# Altium schematic sheet 04pwr_pmic.SchDoc
size B
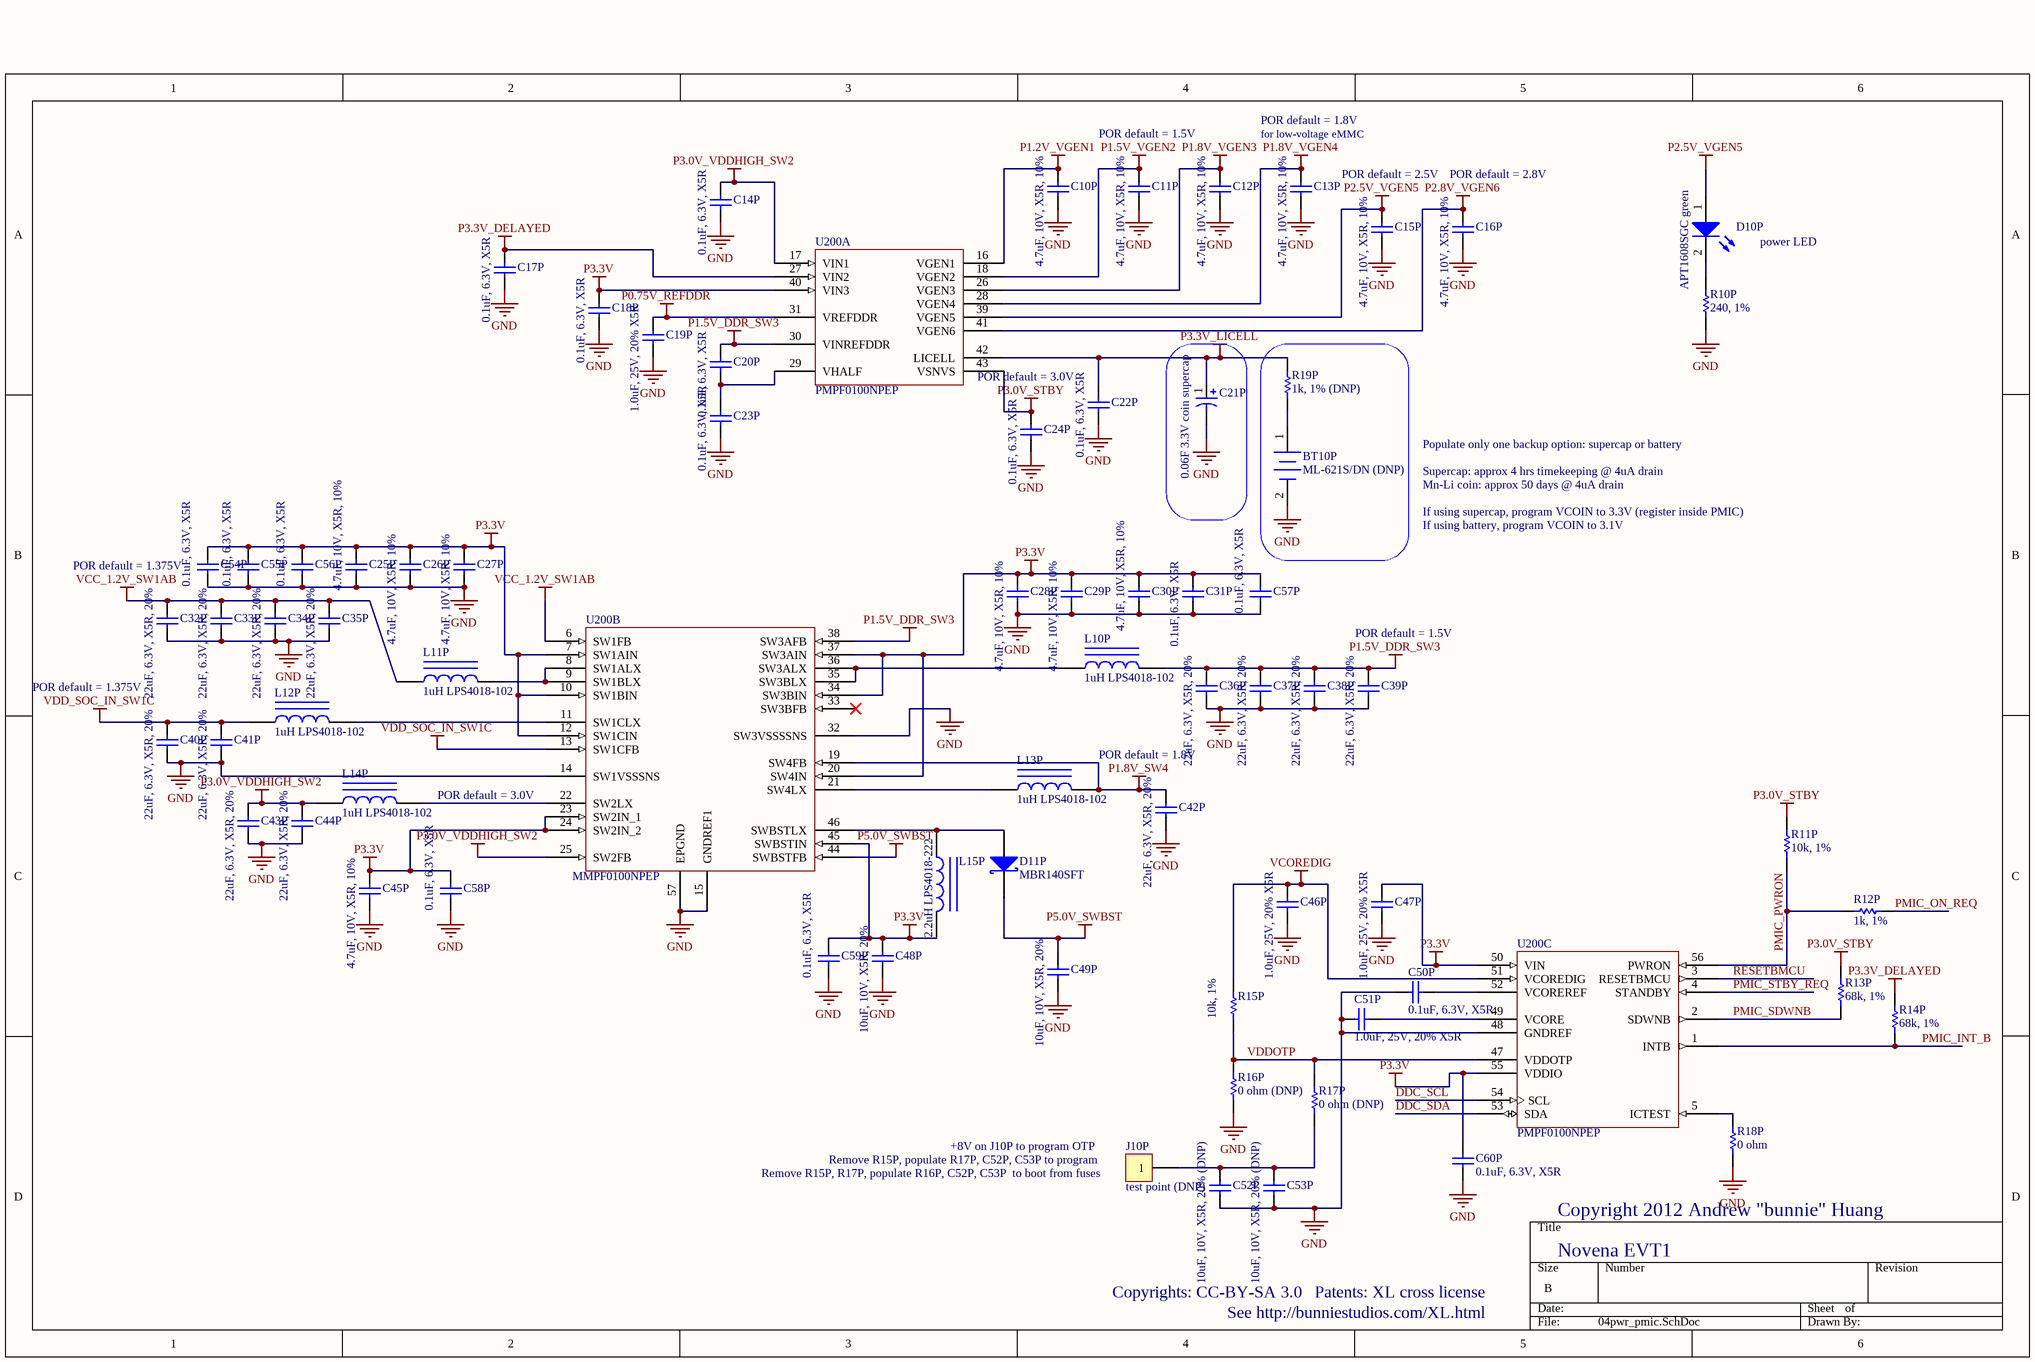
[diagram p0: 04pwr_pmic.SchDoc]

## Parts
BT10P  ML-621S/DN (DNP)  [PAN_ML-621S-DN]
C10P  4.7uF, 10V, X5R, 10%  [CAPC1608N_HD]
C11P  4.7uF, 10V, X5R, 10%  [CAPC1608N_HD]
C12P  4.7uF, 10V, X5R, 10%  [CAPC1608N_HD]
C13P  4.7uF, 10V, X5R, 10%  [CAPC1608N_HD]
C14P  0.1uF, 6.3V, X5R  [CAPC0603N_B]
C15P  4.7uF, 10V, X5R, 10%  [CAPC1608N_HD]
C16P  4.7uF, 10V, X5R, 10%  [CAPC1608N_HD]
C17P  0.1uF, 6.3V, X5R  [CAPC0603N_B]
C18P  0.1uF, 6.3V, X5R  [CAPC0603N_B]
C19P  1.0uF, 25V, 20% X5R  [CAPC1608N_HD]
C20P  0.1uF, 6.3V, X5R  [CAPC0603N_B]
C21P  0.06F 3.3V coin supercap  [TAIYO_YUDEN_PAS414HR-VA5R]
C22P  0.1uF, 6.3V, X5R  [CAPC0603N_B]
C23P  0.1uF, 6.3V, X5R  [CAPC0603N_B]
C24P  0.1uF, 6.3V, X5R  [CAPC0603N_B]
C25P  4.7uF, 10V, X5R, 10%  [CAPC1608N_HD]
C26P  4.7uF, 10V, X5R, 10%  [CAPC1608N_HD]
C27P  4.7uF, 10V, X5R, 10%  [CAPC1608N_HD]
C28P  4.7uF, 10V, X5R, 10%  [CAPC1608N_HD]
C29P  4.7uF, 10V, X5R, 10%  [CAPC1608N_HD]
C30P  4.7uF, 10V, X5R, 10%  [CAPC1608N_HD]
C31P  0.1uF, 6.3V, X5R  [CAPC0603N_B]
C32P  22uF, 6.3V, X5R, 20%  [CAPC1608N_HD]
C33P  22uF, 6.3V, X5R, 20%  [CAPC1608N_HD]
C34P  22uF, 6.3V, X5R, 20%  [CAPC1608N_HD]
C35P  22uF, 6.3V, X5R, 20%  [CAPC1608N_HD]
C36P  22uF, 6.3V, X5R, 20%  [CAPC1608N_HD]
C37P  22uF, 6.3V, X5R, 20%  [CAPC1608N_HD]
C38P  22uF, 6.3V, X5R, 20%  [CAPC1608N_HD]
C39P  22uF, 6.3V, X5R, 20%  [CAPC1608N_HD]
C40P  22uF, 6.3V, X5R, 20%  [CAPC1608N_HD]
C41P  22uF, 6.3V, X5R, 20%  [CAPC1608N_HD]
C42P  22uF, 6.3V, X5R, 20%  [CAPC1608N_HD]
C43P  22uF, 6.3V, X5R, 20%  [CAPC1608N_HD]
C44P  22uF, 6.3V, X5R, 20%  [CAPC1608N_HD]
C45P  4.7uF, 10V, X5R, 10%  [CAPC1608N_HD]
C46P  1.0uF, 25V, 20% X5R  [CAPC1608N_HD]
C47P  1.0uF, 25V, 20% X5R  [CAPC1608N_HD]
C48P  10uF, 10V, X5R, 20%  [CAPC1608N]
C49P  10uF, 10V, X5R, 20%  [CAPC1608N]
C50P  0.1uF, 6.3V, X5R  [CAPC0603N_B]
C51P  1.0uF, 25V, 20% X5R  [CAPC1608N_HD]
C52P  10uF, 10V, X5R, 20% (DNP)  [CAPC1608N]
C53P  10uF, 10V, X5R, 20% (DNP)  [CAPC1608N]
C54P  0.1uF, 6.3V, X5R  [CAPC0603N_B]
C55P  0.1uF, 6.3V, X5R  [CAPC0603N_B]
C56P  0.1uF, 6.3V, X5R  [CAPC0603N_B]
C57P  0.1uF, 6.3V, X5R  [CAPC0603N_B]
C58P  0.1uF, 6.3V, X5R  [CAPC0603N_B]
C59P  0.1uF, 6.3V, X5R  [CAPC0603N_B]
C60P  0.1uF, 6.3V, X5R  [CAPC0603N_B]
D10P  APT1608SGC green  [CD1608-0603]
D11P  MBR140SFT  [SOD123]
J10P  test point (DNP)  [TP_SMT_38mil]
L10P  1uH LPS4018-102  [COILCRAFT_LPS4018]
L11P  1uH LPS4018-102  [COILCRAFT_LPS4018]
L12P  1uH LPS4018-102  [COILCRAFT_LPS4018]
L13P  1uH LPS4018-102  [COILCRAFT_LPS4018]
L14P  1uH LPS4018-102  [COILCRAFT_LPS4018]
L15P  2.2uH LPS4018-222  [COILCRAFT_LPS4018]
R10P  240, 1%  [RESC1005N]
R11P  10k, 1%  [RESC1005N]
R12P  1k, 1%  [RESC1005N]
R13P  68k, 1%  [RESC1005N]
R14P  68k, 1%  [RESC1005N]
R15P  10k, 1%  [RESC1005N]
R16P  0 ohm (DNP)  [RESC1005N]
R17P  0 ohm (DNP)  [RESC1005N]
R18P  0 ohm  [RESC1005N]
R19P  1k, 1% (DNP)  [RESC1005N]
U200  PMPF0100NPEP  [FREESCALE_QFN50P800X800X90-56N]  (parts A,B,C of 3)

## Nets
GND: BT10P.2(-) C10P.2 C11P.2 C12P.2 C13P.2 C14P.2 C15P.2 C16P.2 C17P.2 C18P.2 C19P.2 C21P.2 C22P.2 C23P.2 C24P.2 C25P.2 C26P.2 C27P.2 C28P.2 C29P.2 C30P.2 C31P.2 C32P.2 C33P.2 C34P.2 C35P.2 C36P.2 C37P.2 C38P.2 C39P.2 C40P.2 C41P.2 C42P.2 C43P.2 C44P.2 C45P.2 C46P.2 C47P.2 C48P.2 C49P.2 C50P.2 C51P.2 C52P.2 C53P.2 C54P.2 C55P.2 C56P.2 C57P.2 C58P.2 C59P.2 C60P.1 R10P.1 R16P.1 R18P.1 U200.14(SW1VSSSNS) U200.15(GNDREF1) U200.32(SW3VSSSSNS) U200.48(GNDREF) U200.57(EPGND)
P0.75V_REFDDR: C19P.1 U200.31(VREFDDR)
P1.2V_VGEN1: C10P.1 U200.16(VGEN1)
P1.5V_DDR_SW3: C20P.1 C36P.1 C37P.1 C38P.1 C39P.1 L10P.2 U200.30(VINREFDDR) U200.38(SW3AFB)
P1.5V_VGEN2: C11P.1 U200.18(VGEN2)
P1.8V_SW4: C42P.1 L13P.2 U200.19(SW4FB)
P1.8V_VGEN3: C12P.1 U200.26(VGEN3)
P1.8V_VGEN4: C13P.1 U200.28(VGEN4)
P2.5V_VGEN5: C15P.1 D10P.1(A) U200.39(VGEN5)
P2.8V_VGEN6: C16P.1 U200.41(VGEN6)
P3.0V_STBY: C24P.1 R11P.2 R13P.2 U200.43(VSNVS)
P3.0V_VDDHIGH_SW2: C14P.1 C43P.1 C44P.1 L14P.1 U200.17(VIN1) U200.25(SW2FB)
P3.3V: C18P.1 C25P.1 C26P.1 C27P.1 C28P.1 C29P.1 C30P.1 C31P.1 C45P.1 C47P.1 C48P.1 C54P.1 C55P.1 C56P.1 C57P.1 C58P.1 C59P.1 C60P.2 L15P.2 U200.7(SW1AIN) U200.10(SW1BIN) U200.12(SW1CIN) U200.20(SW4IN) U200.23(SW2IN_1) U200.24(SW2IN_2) U200.34(SW3BIN) U200.37(SW3AIN) U200.40(VIN3) U200.45(SWBSTIN) U200.50(VIN) U200.55(VDDIO)
P3.3V_DELAYED: C17P.1 R14P.2 U200.27(VIN2)
P3.3V_LICELL: C21P.1 C22P.1 R19P.2 U200.42(LICELL)
P5.0V_SWBST: C49P.1 D11P.2(K) U200.44(SWBSTFB)
VCC_1.2V_SW1AB: C32P.1 C33P.1 C34P.1 C35P.1 L11P.1 U200.6(SW1FB)
VCOREDIG: C46P.1 R15P.2 U200.51(VCOREDIG)
VDD_SOC_IN_SW1C: C40P.1 C41P.1 L12P.1 U200.13(SW1CFB)
DDC_SCL: U200.54(SCL)
DDC_SDA: U200.53(SDA)
PMIC_INT_B: R14P.1 U200.1(INTB)
PMIC_ON_REQ: R12P.2
PMIC_PWRON: R11P.1 R12P.1 U200.56(PWRON)
PMIC_SDWNB: R13P.1 U200.2(SDWNB)
PMIC_STBY_REQ: U200.4(STANDBY)
RESETBMCU: U200.3(RESETBMCU)
VDDOTP: R15P.1 R16P.2 R17P.2 U200.47(VDDOTP)
NetBT10P_1: BT10P.1(+) R19P.1
NetC20P_2: C20P.2 C23P.1 U200.29(VHALF)
NetC50P_1: C50P.1 U200.52(VCOREREF)
NetC51P_1: C51P.1 U200.49(VCORE)
NetC52P_1: C52P.1 C53P.1 J10P.1 R17P.1
NetD10P_2: D10P.2(K) R10P.2
NetD11P_1: D11P.1(A) L15P.1 U200.46(SWBSTLX)
NetL10P_1: L10P.1 U200.35(SW3BLX) U200.36(SW3ALX)
NetL11P_2: L11P.2 U200.8(SW1ALX) U200.9(SW1BLX)
NetL12P_2: L12P.2 U200.11(SW1CLX)
NetL13P_1: L13P.1 U200.21(SW4LX)
NetL14P_2: L14P.2 U200.22(SW2LX)
NetR18P_2: R18P.2 U200.5(ICTEST)

Not connected (* = marked no-connect by the designer): U200 33(SW3BFB)*

## Notes on the sheet
- POR default = 1.5V
- for low-voltage eMMC
- POR default = 1.8V
- POR default = 2.5V
- (near C16P) POR default = 2.8V
- power LED
- POR default = 3.0V
- Supercap: approx 4 hrs timekeeping @ 4uA drain
- Mn-Li coin: approx 50 days @ 4uA drain
- Populate only one backup option: supercap or battery
- (near C54P) POR default = 1.375V
- If using supercap, program VCOIN to 3.3V (register inside PMIC)
- If using battery, program VCOIN to 3.1V
- POR default = 1.375V
- (near J10P) Remove R15P, R17P, populate R16P, C52P, C53P  to boot from fuses
- (near J10P) Remove R15P, populate R17P, C52P, C53P to program
- (near J10P) +8V on J10P to program OTP
- (near R18P) Copyright 2012 Andrew "bunnie" Huang
- Copyrights: CC-BY-SA 3.0
- Patents: XL cross license
- Novena EVT1
- See http://bunniestudios.com/XL.html

## Library data of the parts
BT10P = Battery: Panasonic Manganese Lithium Rechargeable battery; Published: 24-Mar-1999; LatestRevisionDate: 17-Jul-2002; LatestRevisionNote: Re-released for DXP Platform.; PackageReference: BAT-2; Publisher: Altium Limited; PackageDescription: Battery; 2 Leads
C10P C11P C12P C13P C14P C15P C16P C17P C18P C19P C20P C22P C23P C24P C25P C26P C27P C28P C29P C30P C31P C32P C33P C34P C35P C36P C37P C38P C39P C40P C41P C42P C43P C44P C45P C46P C47P C48P C49P C50P C51P C52P C53P C54P C55P C56P C57P C58P C59P C60P = Cap Semi: Capacitor (Semiconductor SIM Model); Published: 8-Jun-2000; LatestRevisionDate: 17-Jul-2002; LatestRevisionNote: Re-released for DXP Platform.; PackageReference: C1206; Publisher: Altium Limited
C21P = Cap Pol3: Taiyo Yuden PAS414HR-VA5R; Published: 8-Jun-2000; LatestRevisionDate: 17-Jul-2002; LatestRevisionNote: Re-released for DXP Platform.; PackageReference: C0805; Publisher: Altium Limited
D10P = LED2: Typical RED, GREEN, YELLOW, AMBER GaAs LED; Published: 8-Jun-2000; LatestRevisionDate: 17-Jul-2002; LatestRevisionNote: Re-released for DXP Platform.; PackageVersion: Feb-2002; PackageReference: 3.2X1.6X1.1; Publisher: Altium Limited
D11P = D Schottky: Schottky Diode; Code - JEDEC: DO-214-AA; Published: 8-Jun-2000; Publisher: Altium Limited; Revision: July-2002: Re-released for DXP Platform.
J10P = CON1: Connector
L10P L11P L12P L13P L14P L15P = Inductor Iron: Magnetic-Core Inductor; Published: 24-Mar-1999; LatestRevisionDate: 17-Jul-2002; LatestRevisionNote: Re-released for DXP Platform.; PackageReference: AXIAL-0.9; Publisher: Altium Limited
R10P R11P R12P R13P R14P R15P R16P R17P R18P R19P = Res1: Resistor; Value: 100k; Published: 8-Jun-2000; LatestRevisionDate: 17-Jul-2002; LatestRevisionNote: Re-released for DXP Platform.; PackageReference: AXIAL-0.3; Publisher: Altium Limited
U200 = PMPF0100NPEP: PMIC for i.MX6 series